# EAGLE design MBusTransmitter (EAGLE 9.5.2)
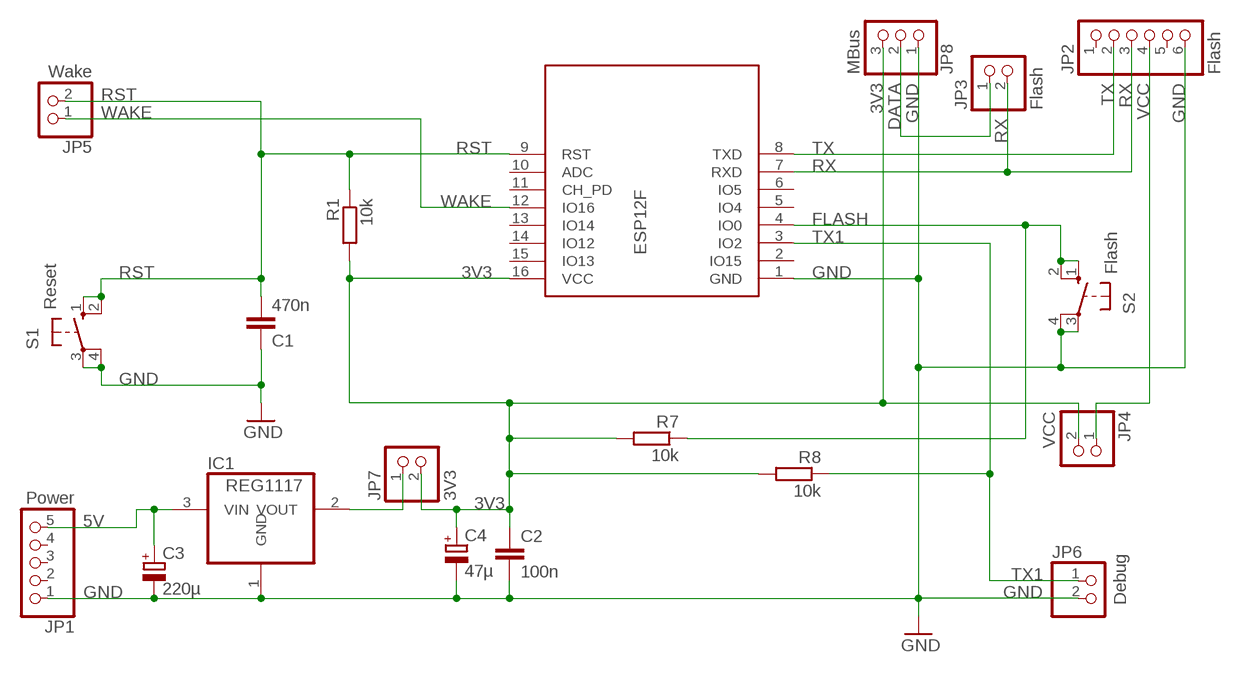
[diagram p0: schematic, sheet 1]

## Parts
C1  470n  C-EU050-024X044  [C050-024X044]
C2  100n  C-EU050-024X044  [C050-024X044]
C3  220µ  CPOL-EUE5-10.5  [E5-10,5]
C4  47µ  CPOL-EUE2.5-5  [E2,5-5]
IC1  REG1117  [SOT223]
JP1  Power  PINHD-1X5  [1X05]
JP2  Flash  PINHD-1X6  [1X06]
JP3  Flash  PINHD-1X2  [1X02]
JP4  VCC  PINHD-1X2  [1X02]
JP5  Wake  PINHD-1X2  [1X02]
JP6  Debug  PINHD-1X2  [1X02]
JP7  3V3  PINHD-1X2  [1X02]
JP8  MBus  PINHD-1X3/90  [1X03/90]
R1  10k  R-EU_0207/10  [0207/10]
R7  10k  R-EU_0207/10  [0207/10]
R8  10k  R-EU_0207/10  [0207/10]
S1  Reset  10-XX  [B3F-10XX]
S2  Flash  10-XX  [B3F-10XX]
U$2  ESP12F  [ESP12F]

## Nets
3V3: C2.1 C4.+ JP4.2 JP7.2 JP8.3 R1.2 R7.2 R8.2 U$2.16(VCC)
5V: C3.+ IC1.3(VIN) JP1.5
DATA: JP3.1 JP8.2
FLASH: R7.1 S2.1(S) S2.2(S1) U$2.4(IO0)
GND: C1.1 C2.2 C3.- C4.- IC1.1(GND) JP1.1 JP2.6 JP6.2 JP8.1 S1.3(P) S1.4(P1) S2.3(P) S2.4(P1) U$2.1(GND)
N$1: IC1.2(VOUT) JP7.1
RST: C1.2 JP5.2 R1.1 S1.1(S) S1.2(S1) U$2.9(RST)
RX: JP2.3 JP3.2 U$2.7(RXD)
TX: JP2.2 U$2.8(TXD)
TX1: JP6.1 R8.1 U$2.3(IO2)
VCC: JP2.4 JP4.1
WAKE: JP5.1 U$2.12(IO16)
Unconnected: JP1.2 JP1.3 JP1.4 JP2.1 JP2.5 U$2.2(IO15) U$2.5(IO4) U$2.6(IO5) U$2.10(ADC) U$2.11(CH_PD) U$2.13(IO14) U$2.14(IO12) U$2.15(IO13)

## Library data of the parts
C1 C2 = rcl:C-EU: CAPACITOR, European symbol; SPICEPREFIX: C
C3 C4 = rcl:CPOL-EU: POLARIZED CAPACITOR, European symbol; SPICEPREFIX: C
IC1 = burr-brown:REG1117: 800mA and 1A Low Dropout (LDO) Positive Regulator 1.8V, 2.5V, 2.85V, 3.3V, 5V, and Adj; MPN: REG1117; OC_FARNELL: 1097566; OC_NEWARK: 14P6981
JP1 = pinhead:PINHD-1X5: PIN HEADER
JP2 = pinhead:PINHD-1X6: PIN HEADER
JP3-JP7 = pinhead:PINHD-1X2: PIN HEADER
JP8 = pinhead:PINHD-1X3: PIN HEADER
R1 R7 R8 = resistor:R-EU_: RESISTOR, European symbol
S1 S2 = switch-omron:10-XX: OMRON SWITCH; MPN: B3F-1000; OC_FARNELL: 176432; OC_NEWARK: 36M3542
U$2 = MyLib:ESP12F: ESP12F

## Board
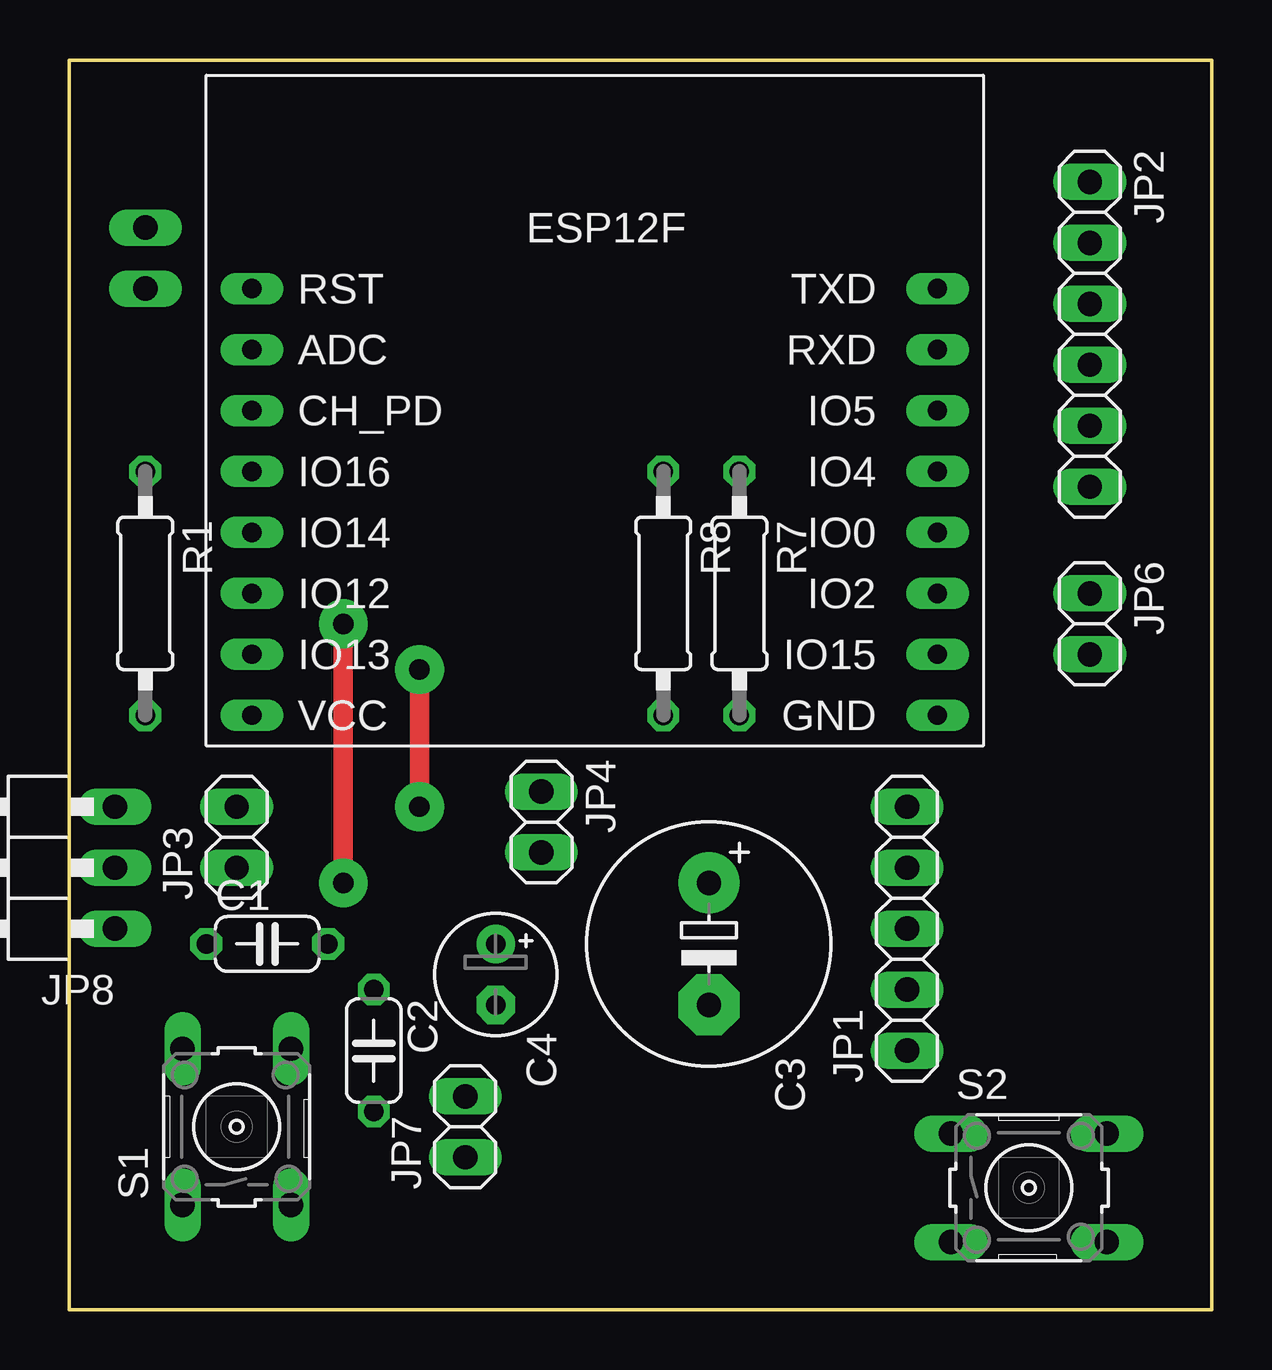
[diagram p1: board, top side]
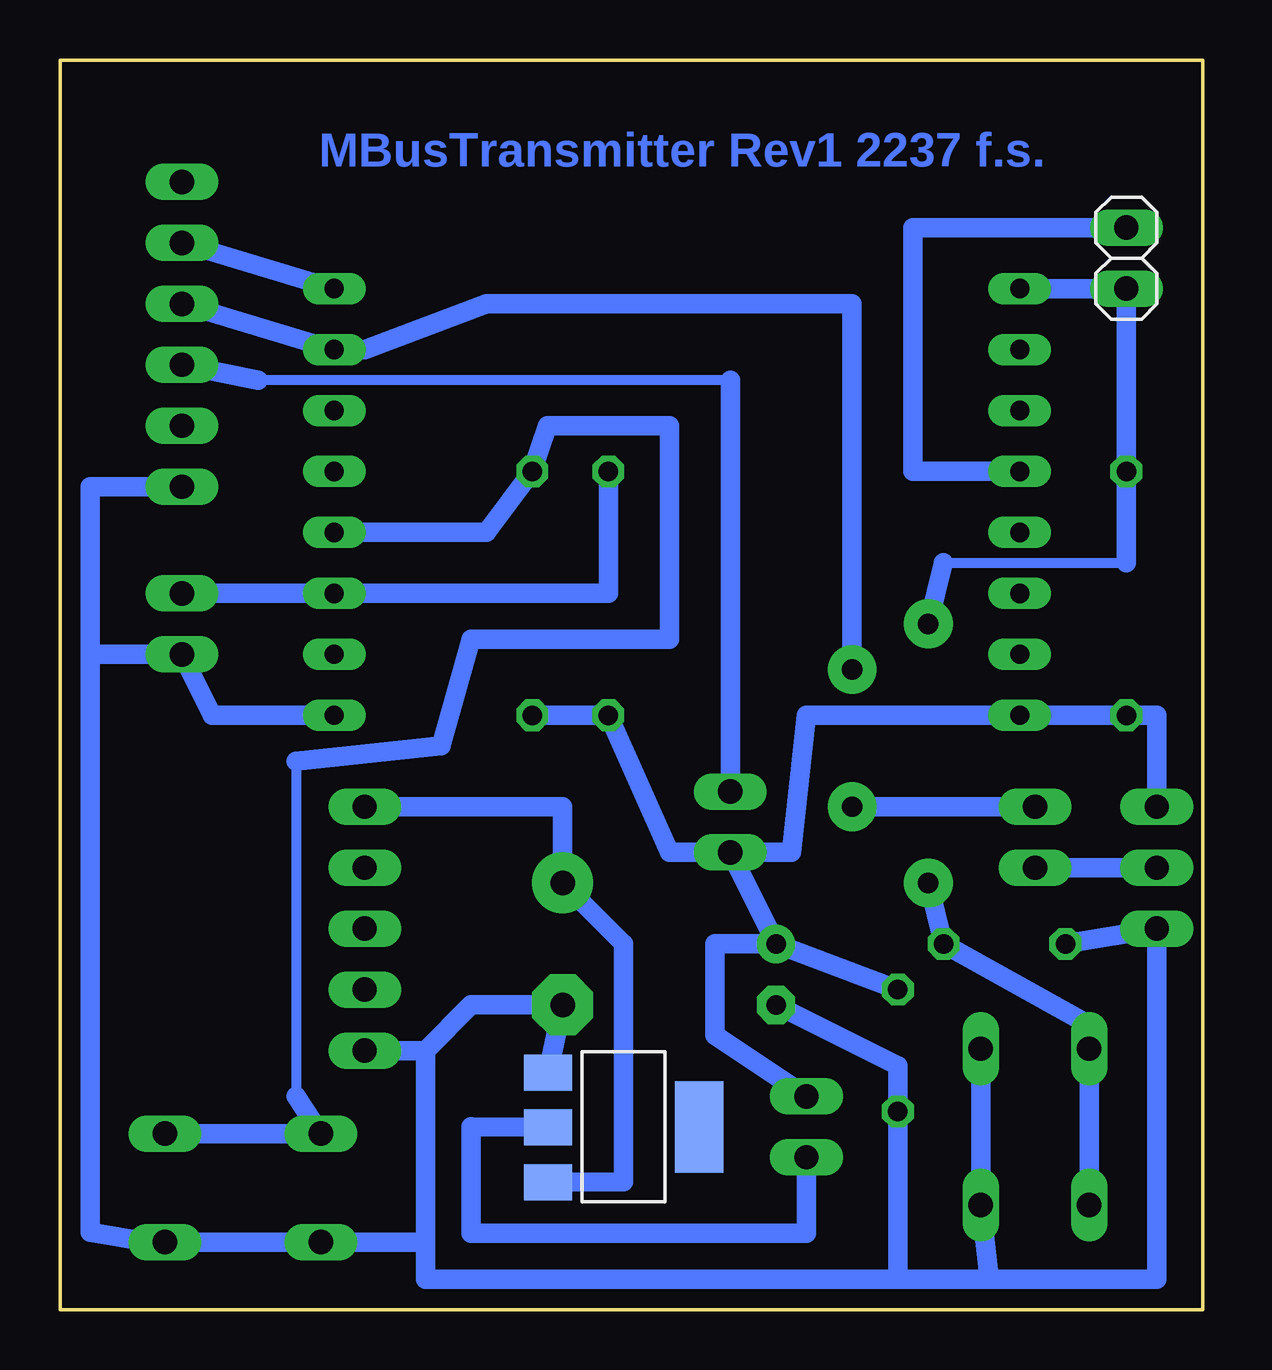
[diagram p2: board, bottom side, seen from below]

Size 47.62 x 52.07 mm. Coordinates in mm from the lower left corner, seen from the top.
Outline: 0,0 47.62,0 47.62,52.07 0,52.07 0,0
Copper layers (1*16): Top 0.035mm / dielectric 1.5mm / Bottom 0.035mm
Design rules "MyLayout": minimum track width 24mil, minimum drill 24mil, track to track 8mil, track to pad 8mil, pad to pad 8mil, via to via 8mil, smd to smd 8mil, copper to edge 20mil, drill to drill 8mil, minimum pad ring 10mil, minimum via ring 8mil, stop-mask expansion 4mil, vias tented up to drill 0mil, thermal gap 10mil

### Footprints (pad centres in the part's own frame; a part is rotated, then mirrored left to right if it is on the bottom)
C050-024X044 = drill 0.813 octagon: 1 -2.54,0; 2 2.54,0
E5-10,5 = drill 1.016 pad 2.54: + -2.54,0 | drill 1.016 pad 2.54 octagon: - 2.54,0
E2,5-5 = drill 0.813 pad 1.6: + -1.27,0 | drill 0.813 pad 1.6 octagon: - 1.27,0
SOT223 = smd 1.499 x 2.007: 1 -2.261,-3.15; 2 0.025,-3.15; 3 2.311,-3.15 | smd 3.81 x 2.007: 4 0,3.15
1X05 = drill 1.016 long: 1 -5.08,0; 2 -2.54,0; 3 0,0; 4 2.54,0; 5 5.08,0
1X06 = drill 1.016 long: 1 -6.35,0; 2 -3.81,0; 3 -1.27,0; 4 1.27,0; 5 3.81,0; 6 6.35,0
1X02 = drill 1.016 long: 1 -1.27,0; 2 1.27,0
1X03/90 = drill 1.016 long: 1 -2.54,-3.81; 2 0,-3.81; 3 2.54,-3.81
0207/10 = drill 0.813 octagon: 1 -5.08,0; 2 5.08,0
B3F-10XX = drill 1.016 long: 1 -3.251,2.261; 2 3.251,2.261; 3 -3.251,-2.261; 4 3.251,-2.261
ESP12F = drill 0.8 long: 1 13.97,-13.97; 2 13.97,-11.43; 3 13.97,-8.89; 4 13.97,-6.35; 5 13.97,-3.81; 6 13.97,-1.27; 7 13.97,1.27; 8 13.97,3.81; 9 -14.605,3.81; 10 -14.605,1.27; 11 -14.605,-1.27; 12 -14.605,-3.81; 13 -14.605,-6.35; 14 -14.605,-8.89; 15 -14.605,-11.43; 16 -14.605,-13.97

### Placement (x,y rotation side)
C1  8.26,15.24 0 top
C2  12.7,10.79 270 top
C3  26.67,15.24 270 top
C4  17.78,13.97 270 top
IC1  24.13,7.62 270 bottom
JP1  34.92,15.88 90 top
JP2  42.55,40.64 270 top
JP3  6.99,19.68 90 top
JP4  19.68,20.32 270 top
JP5  3.17,43.81 270 bottom
JP6  42.55,28.57 270 top
JP7  16.51,7.62 90 top
JP8  -1.91,18.41 90 top
R1  3.17,29.84 270 top
R7  27.94,29.84 270 top
R8  24.77,29.84 270 top
S1  6.99,7.62 90 top
S2  40.01,5.08 0 top
U$2  22.23,38.73 0 top

### Tracks (layer width: path | path; a pad name or v marks a point on that pad's centre or on a via)
3V3
  Bottom 0.813: C4.+ 20.32,15.24 20.32,11.43 JP7.2 | C2.1 C4.+ | JP8.3 1.91,24.77 R1.2 U$2.16 16.51,24.77 17.14,19.05 JP4.2 | R7.2 R8.2 22.23,19.05 JP4.2 | JP4.2 C4.+
5V
  Bottom 0.813: JP1.5 26.67,20.95 C3.+ 24.13,15.24 24.13,5.33 IC1.3
DATA
  Bottom 0.813: JP8.2 JP3.1
FLASH
  Bottom 0.406: 37.78,22.86 37.78,8.89
  Bottom 0.813: S2.2 S2.1 37.78,8.89 | U$2.4 29.84,32.38 R7.1 27.3,36.83 22.23,36.83 22.23,27.94 30.48,27.94 31.75,23.5 37.78,22.86
GND
  Bottom 0.813: S1.4 S1.3 8.89,1.27 | 12.7,1.27 32.38,1.27 32.38,2.82 | 32.38,2.82 S2.3 S2.4 43.89,2.82 46.35,3.23 46.35,27.3 | 32.38,10.79 30.48,12.7 C3.- IC1.1 | 32.38,10.79 32.38,2.82 | JP1.1 32.38,10.79 | 12.7,1.27 C2.2 12.7,10.16 C4.- | 8.89,1.27 1.91,1.27 JP8.1 C1.1 | 8.89,1.27 12.7,1.27 | U$2.1 41.27,24.77 JP6.2 46.35,27.3 | JP2.6 46.35,34.29 46.35,27.3
N$1
  Bottom 0.813: IC1.2 30.48,7.62 30.48,3.17 16.51,3.17 JP7.1
RST  (via drill 0.85 pad 2.03)
  Top 0.813: v11.43,17.78 v11.43,28.57
  Bottom 0.406: 10.79,31.11 3.17,31.11
  Bottom 0.813: S1.1 S1.2 5.08,12.06 C1.2 v11.43,17.78 | U$2.9 JP5.2 R1.1 3.17,31.11 | v11.43,28.57 10.79,31.11
RX  (via drill 0.85 pad 2.03)
  Top 0.813: v14.61,26.67 v14.61,20.95
  Bottom 0.813: JP2.3 U$2.7 34.92,40.01 29.84,41.91 14.61,41.91 v14.61,26.67 | JP3.2 v14.61,20.95
TX
  Bottom 0.813: U$2.8 JP2.2
TX1
  Bottom 0.813: R8.1 24.77,29.84 U$2.3 JP6.1
VCC
  Bottom 0.406: 19.68,38.73 39.37,38.73
  Bottom 0.813: JP4.1 19.68,38.73 | 39.37,38.73 JP2.4
WAKE
  Bottom 0.813: U$2.12 12.06,34.92 12.06,45.09 JP5.1

### Text on the board
Bottom: MBusTransmitter Rev1 2237 f.s.
Document: MBusTransmitter Rev1 2237 f.s. | TX | RX | VCC | Wake | Flash | GND | TX | GND | Debug | 3V3 | VCC Flash | DATA | open to flush | GND | M-Bus | Power | 3V3 | Reset | Flash